# EAGLE board lisa_m (EAGLE 6.3)
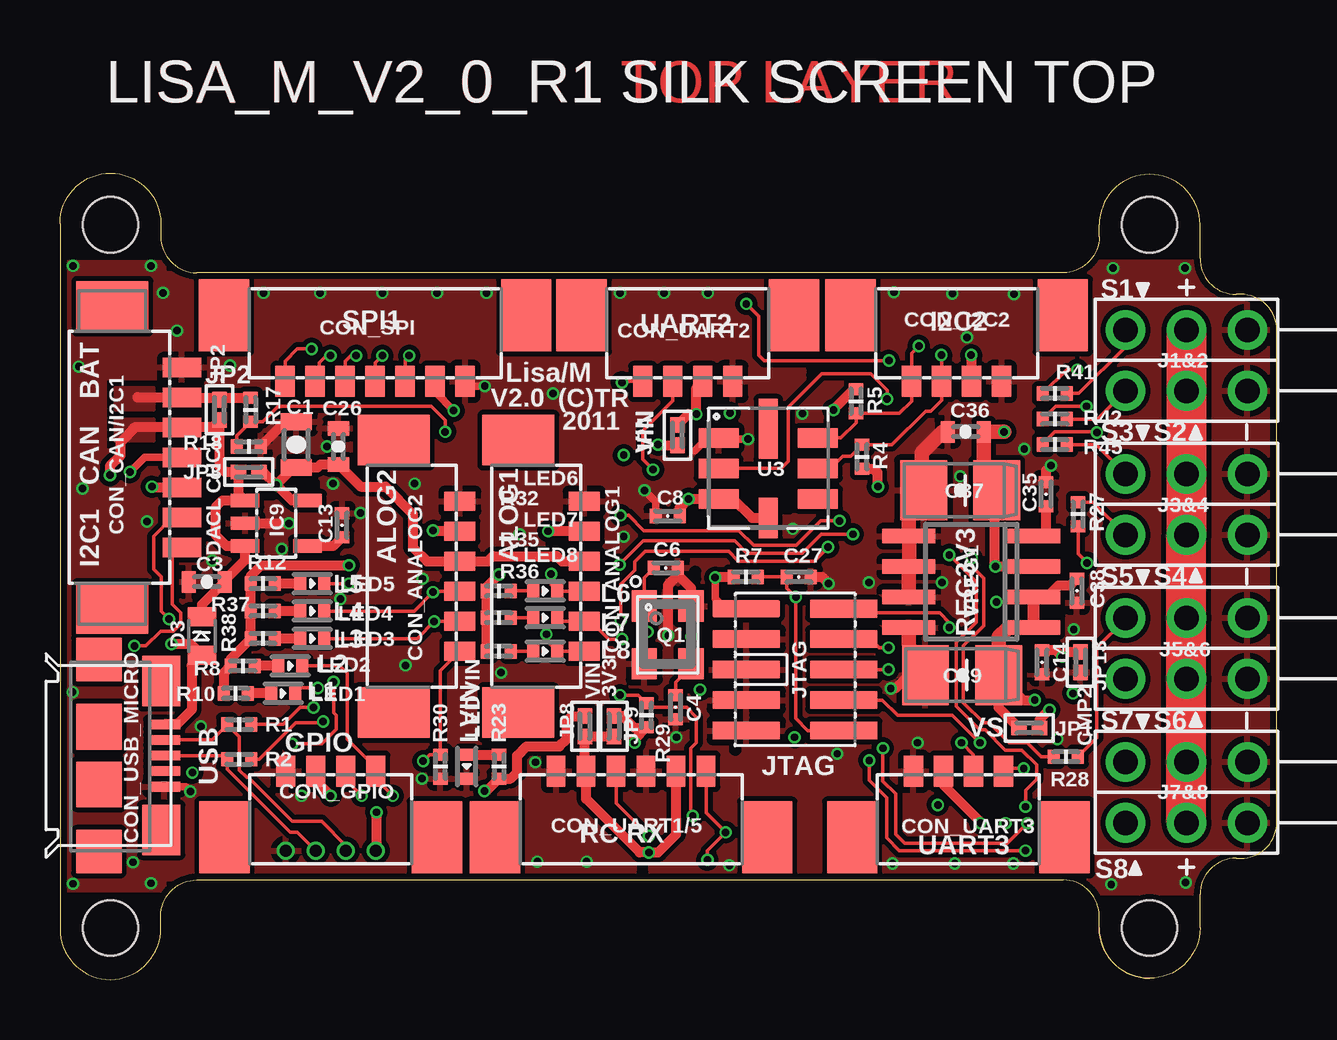
[diagram p3: board, top side]
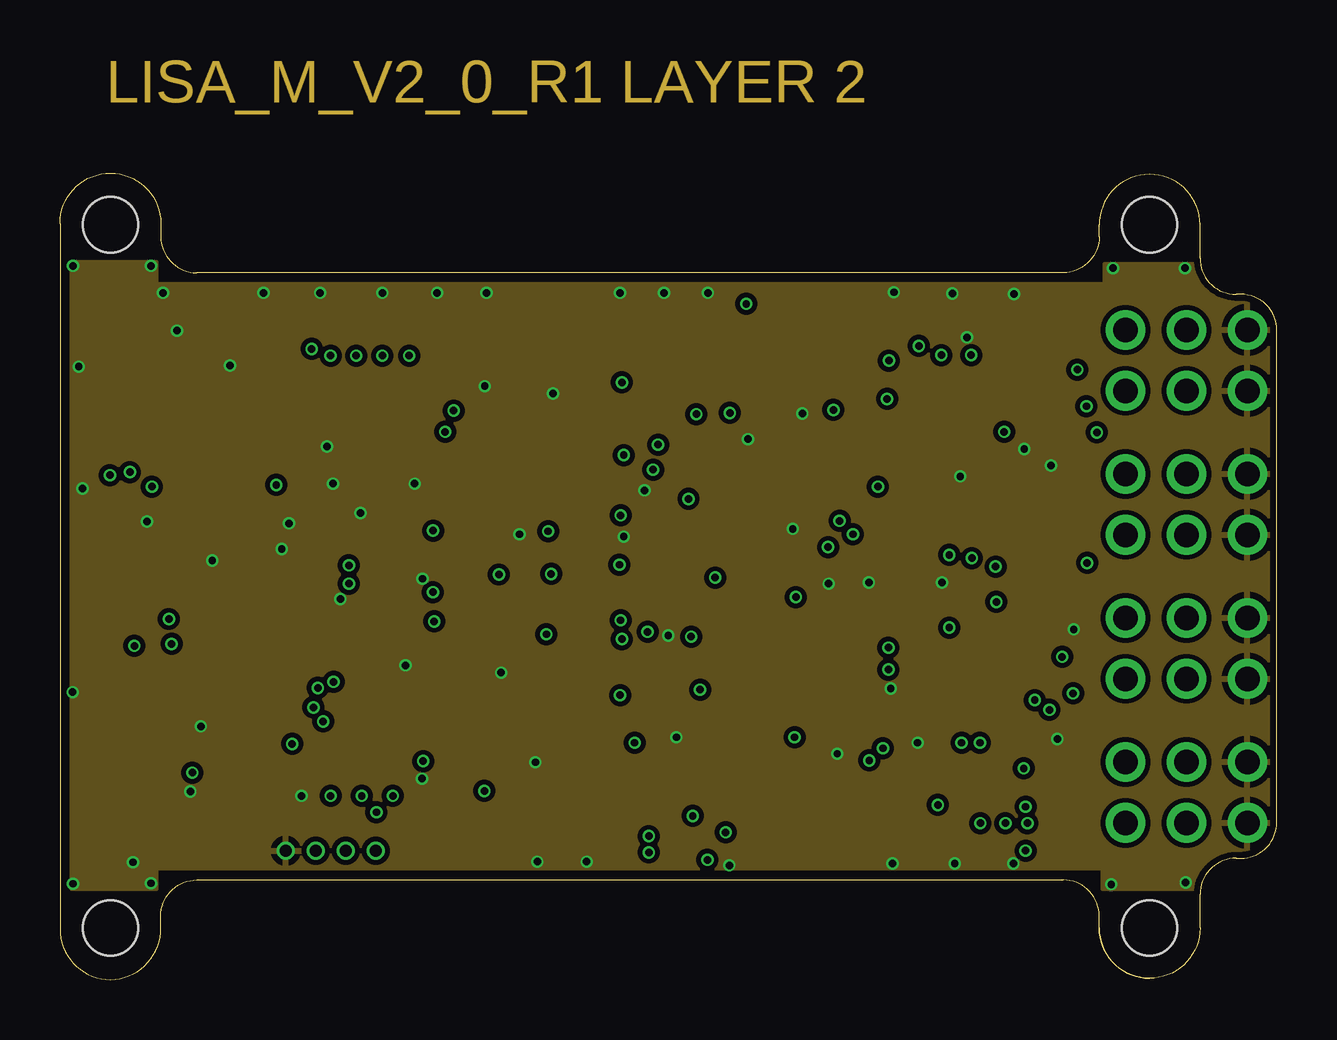
[diagram p4: board, inner layer Route2]
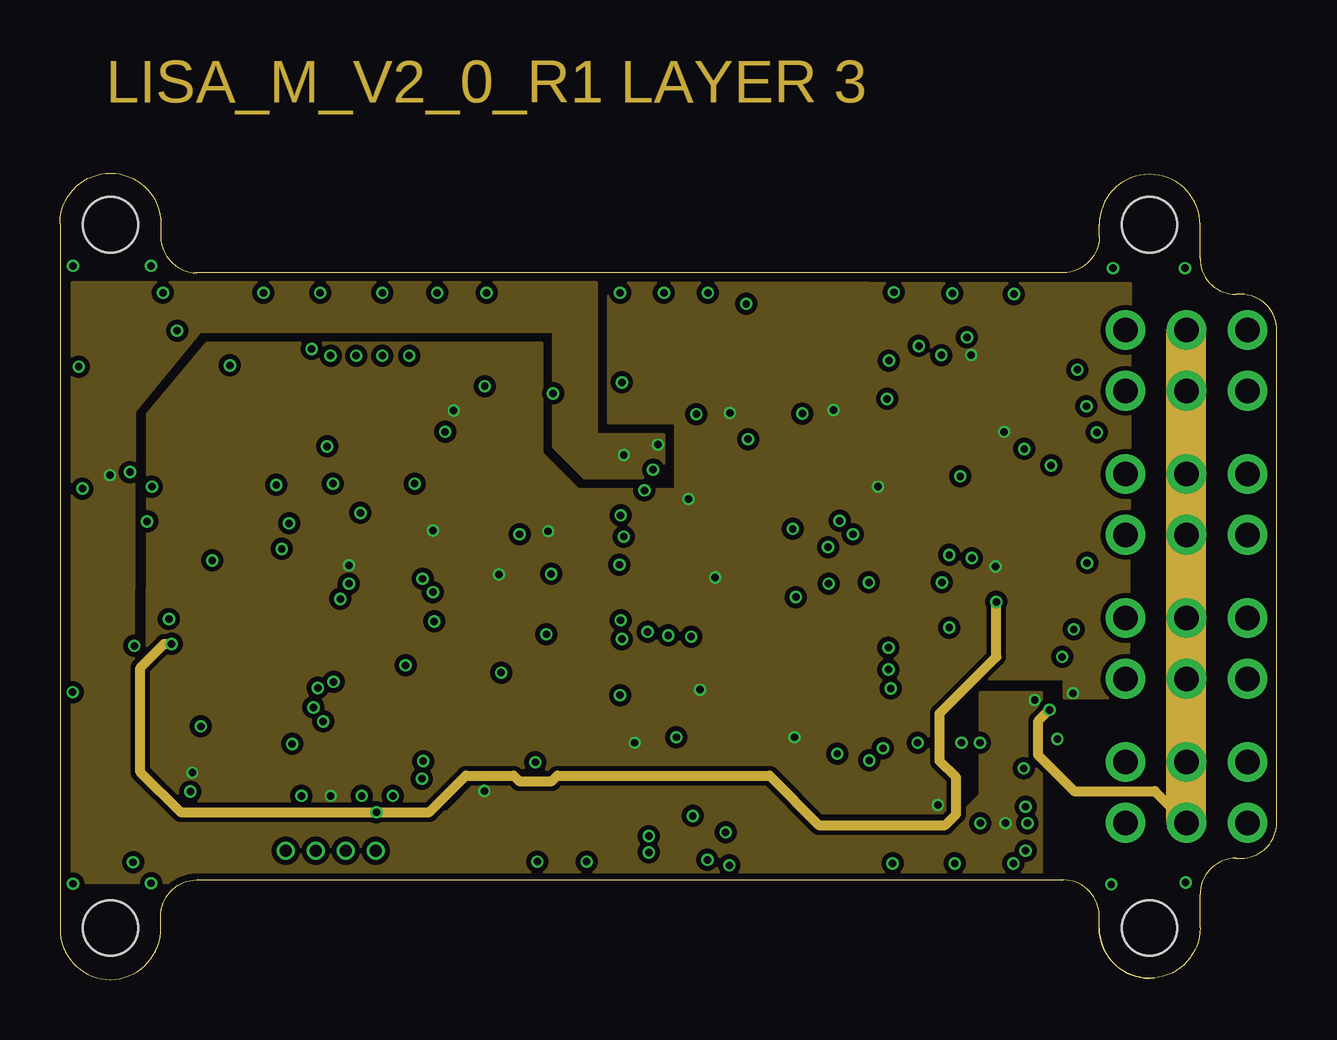
[diagram p5: board, inner layer Route15]
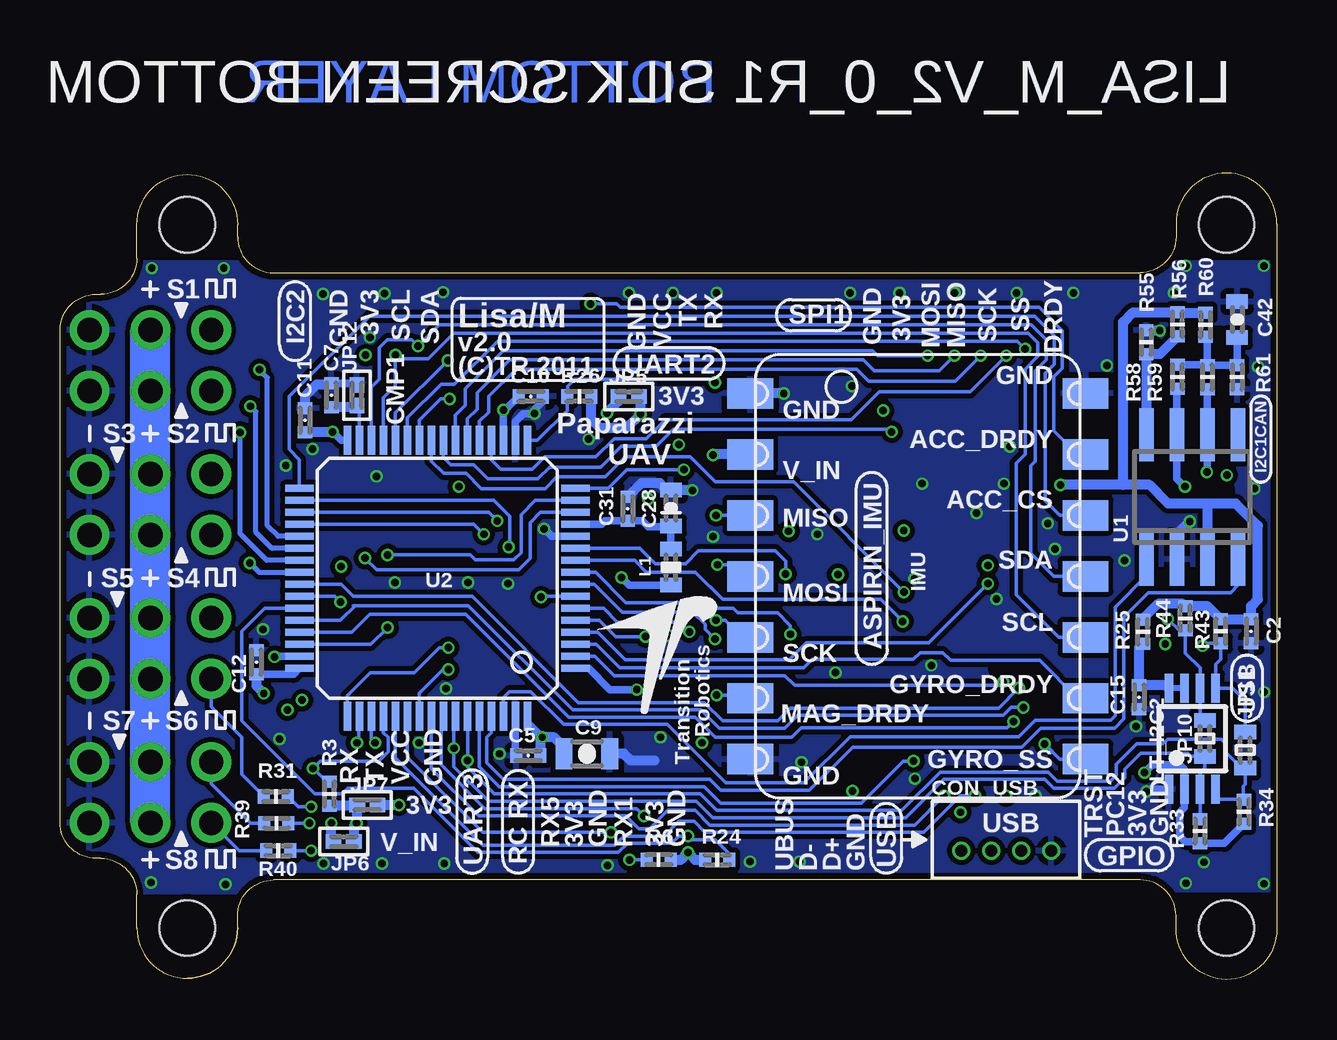
[diagram p6: board, bottom side, seen from below]

Size 50.7 x 33.6 mm. Coordinates in mm from the lower left corner, seen from the top.
Outline: 43.3,2.15 arc90 45.4,0.05
Outline: 45.4,0.05 arc-90 43.3,2.15
Outline: 43.3,2.15 43.3,2.65 arc90 41.8,4.15 5.7,4.15 arc90 4.2,2.65 4.2,2.15 arc-90 2.1,0 arc-90 0,2.1 0,31.5 arc-90 2.1,33.6 arc-90 4.2,31.5 4.2,30.95 arc90 5.7,29.45 41.8,29.45 arc90 43.3,30.95 43.3,31.45 arc-90 45.4,33.55 arc-90 47.5,31.45 47.5,30.05 arc90 49,28.55 49.2,28.55 arc-90 50.7,27.05 50.7,6.55 arc-90 49.2,5.05 49,5.05 arc90 47.5,3.55 47.5,2.15 arc-90 45.4,0.05
Copper layers (1*2+15*16): Top 0.035mm / dielectric 0.2mm / Route2 0.035mm / dielectric 1.5mm / Route15 0.035mm / dielectric 0.2mm / Bottom 0.035mm
Design rules "default": minimum track width 0.15mm, minimum drill 0.3mm, track to track 0.15mm, track to pad 0.15mm, pad to pad 0.15mm, via to via 0.15mm, smd to smd 0.15mm, copper to edge 10mil, drill to drill 8mil, minimum pad ring 0.1mm, minimum via ring 0.1mm, stop-mask expansion 14mil, vias tented up to drill 0.31mm, thermal gap 10mil
Net classes: 0 default: width 0.152 mm, drill 0.305 mm, clearance 0.152 mm
Holes 2.3 mm at 2.1,2.15 2.1,31.45 45.4,31.45 45.4,2.15
tKeepout: area 0.1,0.2 to 4.1,4.2; area 43.4,0.2 to 47.4,4.2; area 0.1,29.5 to 4.1,33.5; area 43.4,29.5 to 47.4,33.5
tRestrict: area 41.6,15.2 to 41.7,15.4; area 39.5,15.1 to 39.6,15.5; area 40.3,20.3 to 40.6,20.3; area 27.3,23.2 to 27.6,23.3; area 31.3,25.2 to 31.4,25.5; area 26.4,16.7 to 26.5,17; area 24.9,16.4 to 25,16.6; area 7.4,16.3 to 7.5,16.5; area 13.2,21 to 13.5,21.1; area 40.4,13 to 40.7,13.1; area 35.8,17.8 to 36.1,17.9; area 22.8,17.6 to 22.9,17.7; 12 more areas
bRestrict: area 2.3,26.9 to 2.5,27; area 2,20.3 to 2.1,20.5; area 2.2,24.5 to 2.3,24.7; area 7.9,23.5 to 8.1,23.6; area 3.5,16.8 to 3.6,17; area 4.8,16.8 to 4.9,17; area 0.4,14.5 to 0.5,14.6; area 5.1,10.4 to 5.2,10.6; area 11.7,12.8 to 11.8,13; area 27.5,20 to 27.6,20.2; area 30.5,24.7 to 30.7,24.9; area 31.3,9.9 to 31.4,10.1; 3 more areas

## Footprints (pad centres in the part's own frame; a part is rotated, then mirrored left to right if it is on the bottom)
0805-CAP = smd 0.7 x 1.3: P$1 -0.95,0; P$2 0.95,0
0402-CAP = smd 0.5 x 0.6: P$1 -0.5,0; P$2 0.5,0
0603-CAP = smd 0.6 x 0.9: P$1 -0.75,0; P$2 0.75,0
0603-POL-CAP = smd 0.6 x 0.9: + -0.75,0; - 0.75,0
3528/B = smd 1.95 x 2.5: + -1.525,0; - 1.525,0
PB-53398-06 = smd 0.8 x 1.3: 1 -3.125,1.25; 2 -1.875,1.25; 3 -0.625,1.25; 4 0.625,1.25; 5 1.875,1.25; 6 3.125,1.25 | smd 2.1 x 3: PAD1 -5.675,-1.5; PAD2 5.675,-1.5
PB-53261-07 = smd 0.8 x 1.6: 1 -3.75,1.1; 2 -2.5,1.1; 3 -1.25,1.1; 4 0,1.1; 5 1.25,1.1; 6 2.5,1.1; 7 3.75,1.1 | smd 2.1 x 3: MNT1 -6.3,-1.8; MNT2 6.3,-1.8
PB-53398-04 = smd 0.8 x 1.3: 1 -1.875,1.25; 2 -0.625,1.25; 3 0.625,1.25; 4 1.875,1.25 | smd 2.1 x 3: PAD1 -4.425,-1.5; PAD2 4.425,-1.5
PB-53398-07 = smd 0.8 x 1.3: 1 -3.75,1.25; 2 -2.5,1.25; 3 -1.25,1.25; 4 0,1.25; 5 1.25,1.25; 6 2.5,1.25; 7 3.75,1.25 | smd 2.1 x 3: PAD1 -6.3,-1.5; PAD2 6.3,-1.5
PB-53398-06' = smd 0.775 x 1.3: 1 -3.125,1.25; 2 -1.875,1.25; 3 -0.625,1.25; 4 0.625,1.25; 5 1.875,1.25; 6 3.125,1.25 | smd 2.1 x 3: PAD1 -5.675,-1.5; PAD2 5.675,-1.5
PB-53047-04 = drill 0.5: 1 -1.875,0; 2 -0.625,0; 3 0.625,0; 4 1.875,0
ZX62-B-5PA = smd 1.8 x 1.9: GND_LEFT -4,0; GND_RIGHT 4,0 | smd 1.9 x 1.9: GND_MID_LEFT -1.2,0; GND_MID_RIGHT 1.2,0 | smd 2.1 x 1.6: GND_UP_LEFT -3.1,2.6; GND_UP_RIGHT 3.1,2.6 | smd 0.4 x 1.35: PIN_1 -1.3,2.725; PIN_2 -0.65,2.725; PIN_3 0,2.725; PIN_4 0.65,2.725; PIN_5 1.3,2.725
MICROMELF-R = smd 0.8 x 1.2: A 0.8,0; C -0.8,0
SOT23-5 = smd 0.55 x 1.2: 1 -0.95,-1.3; 2 0,-1.3; 3 0.95,-1.3; 4 0.95,1.3; 5 -0.95,1.3
ASPIRIN_1 = smd 1.905 x 1.27: P$1 -6.985,7.62; P$2 -6.985,5.08; P$3 -6.985,2.54; P$4 -6.985,0; P$5 -6.985,-2.54; P$6 -6.985,-5.08; P$7 -6.985,-7.62; P$8 6.985,-7.62; P$9 6.985,-5.08; P$10 6.985,-2.54; P$11 6.985,0; P$12 6.985,2.54; P$13 6.985,5.08; P$14 6.985,7.62
SIP1X3_100 = drill 1.016 pad 1.651: 1 2.54,0; 2 0,0; 3 -2.54,0
0402-SQJMP = smd 0.652 x 0.6: P$1 -0.424,0; P$2 0.424,0
0603-RES = smd 0.6 x 0.9: P$1 -0.75,0; P$2 0.75,0
FTSH-105-DV = smd 0.74 x 2.8: 1 -2.54,-2.03; 2 -2.54,2.03; 3 -1.27,-2.03; 4 -1.27,2.03; 5 0,-2.03; 6 0,2.03; 7 1.27,-2.03; 8 1.27,2.03; 9 2.54,-2.03; 10 2.54,2.03
0603-IND = smd 0.6 x 0.9: P$1 -0.75,0; P$2 0.75,0
0402-LED = smd 0.5 x 0.6: A 0.5,0; C -0.5,0
TSSOP_B3 = smd 1.2 x 0.35: 1 -2.925,0.975; 2 -2.925,0.325; 3 -2.925,-0.325; 4 -2.925,-0.975; 5 1.275,-0.975; 6 1.275,-0.325; 7 1.275,0.325; 8 1.275,0.975
ABM8 = smd 1.3 x 1.05: P$1 -1.2,-0.975; P$2 1.2,-0.975; P$3 1.2,0.975; P$4 -1.2,0.975
0402-RES = smd 0.5 x 0.6: P$1 -0.5,0; P$2 0.5,0
SO-08 = smd 0.6 x 2.2: 1 -1.905,-2.6; 2 -0.635,-2.6; 3 0.635,-2.6; 4 1.905,-2.6; 5 1.905,2.6; 6 0.635,2.6; 7 -0.635,2.6; 8 -1.905,2.6
LQFP64 = smd 1.2 x 0.3: 1 -5.75,3.75; 2 -5.75,3.25; 3 -5.75,2.75; 4 -5.75,2.25; 5 -5.75,1.75; 6 -5.75,1.25; 7 -5.75,0.75; 8 -5.75,0.25; 9 -5.75,-0.25; 10 -5.75,-0.75; 11 -5.75,-1.25; 12 -5.75,-1.75; 13 -5.75,-2.25; 14 -5.75,-2.75; 15 -5.75,-3.25; 16 -5.75,-3.75; 33 5.75,-3.75; 34 5.75,-3.25; 35 5.75,-2.75; 36 5.75,-2.25; 37 5.75,-1.75; 38 5.75,-1.25; 39 5.75,-0.75; 40 5.75,-0.25; 41 5.75,0.25; 42 5.75,0.75; 43 5.75,1.25; 44 5.75,1.75; 45 5.75,2.25; 46 5.75,2.75; 47 5.75,3.25; 48 5.75,3.75 | smd 0.3 x 1.2: 17 -3.75,-5.75; 18 -3.25,-5.75; 19 -2.75,-5.75; 20 -2.25,-5.75; 21 -1.75,-5.75; 22 -1.25,-5.75; 23 -0.75,-5.75; 24 -0.25,-5.75; 25 0.25,-5.75; 26 0.75,-5.75; 27 1.25,-5.75; 28 1.75,-5.75; 29 2.25,-5.75; 30 2.75,-5.75; 31 3.25,-5.75; 32 3.75,-5.75; 49 3.75,5.75; 50 3.25,5.75; 51 2.75,5.75; 52 2.25,5.75; 53 1.75,5.75; 54 1.25,5.75; 55 0.75,5.75; 56 0.25,5.75; 57 -0.25,5.75; 58 -0.75,5.75; 59 -1.25,5.75; 60 -1.75,5.75; 61 -2.25,5.75; 62 -2.75,5.75; 63 -3.25,5.75; 64 -3.75,5.75
LCC8 = smd 1.67 x 0.8: 1 -2.065,1.27; 2 -2.065,0; 3 -2.065,-1.27; 5 2.065,-1.27; 6 2.065,0; 7 2.065,1.27 | smd 0.8 x 1.67: 4 0,-2.065 | smd 0.8 x 2.5: 8 0,1.65
SOIC8 = smd 0.6 x 2.2: 1 -1.905,-2.6; 2 -0.635,-2.6; 3 0.635,-2.6; 4 1.905,-2.6; 5 1.905,2.6; 6 0.635,2.6; 7 -0.635,2.6; 8 -1.905,2.6

## Placement (x,y rotation side)
C1  4u7  [0805-CAP]  9.85,22.29 90 top
C2  100n  [0402-CAP]  1.07,14.51 270 bottom
C3  100n  [0603-CAP]  6.12,16.57 180 top
C4  10p  [0402-CAP]  25.65,11.34 90 top
C5  100n  [0402-CAP]  31.19,9.33 0 bottom
C6  10p  [0402-CAP]  25.25,17.15 0 top
C7  100n  [0402-CAP]  39.4,24.34 270 bottom
C8  100n  [0402-CAP]  25.32,19.31 0 top
C9  4u7  [0805-CAP]  28.75,9.41 0 bottom
C10  100n  [0402-CAP]  31.08,24.29 180 bottom
C11  100n  [0402-CAP]  40.49,23.31 270 bottom
C12  100n  [0402-CAP]  42.52,13.22 270 bottom
C13  10n  [0402-CAP]  11.75,18.93 90 top
C14  100n  [0402-CAP]  40.92,13.22 90 top
C15  100n  [0402-CAP]  5.73,11.77 270 bottom
C26  100n  [0603-CAP]  11.6,22.21 90 top
C27  100n  [0402-CAP]  30.79,16.77 180 top
C28  1u  [0603-POL-CAP]  25.24,19.64 90 bottom
C31  10n  [0402-CAP]  27.05,19.62 270 bottom
C35  470p  [0402-CAP]  41.09,20.23 90 top
C36  100n  [0603-CAP]  37.74,22.82 180 top
C37  22u  [3528/B]  37.51,20.38 180 top
C38  100n  [0402-CAP]  42.37,16.19 270 top
C39  22u  [3528/B]  37.59,12.68 180 top
C42  4n7  [0603-CAP]  1.65,27.5 270 bottom
CON_ANALOG1  [PB-53398-06]  20.59,16.8 270 top
CON_ANALOG2  [PB-53398-06]  15.41,16.8 270 top
CON_CAN/I2C1  [PB-53261-07]  3.98,21.75 270 top
CON_GPIO  [PB-53398-04]  11.28,7.43 0 top
CON_I2C2  [PB-53398-04]  37.36,26.17 180 top
CON_SPI  [PB-53398-07]  13.13,26.17 180 top
CON_UART1/5  [PB-53398-06']  23.79,7.43 0 top
CON_UART2  [PB-53398-04]  26.16,26.17 180 top
CON_UART3  [PB-53398-04]  37.43,7.43 0 top
CON_USB  [PB-53047-04]  11.28,5.37 0 bottom
CON_USB_MICRO  ZX62-B-5PA  [ZX62-B-5PA]  1.62,9.33 270 top
D3  1N5819  [MICROMELF-R]  5.91,14.31 270 top
IC9  LP2992 5V  [SOT23-5]  9.01,19.01 270 top
IMU  ASPIRIN  [ASPIRIN_1]  14.96,16.8 0 bottom
J1  CONN_3-1  [SIP1X3_100]  46.94,27.07 0 top
J2  CONN_3-1  [SIP1X3_100]  46.94,24.53 0 top
J3  CONN_3-1  [SIP1X3_100]  46.94,21.07 0 top
J4  CONN_3-1  [SIP1X3_100]  46.94,18.53 0 top
J5  CONN_3-1  [SIP1X3_100]  46.94,15.07 0 top
J6  CONN_3-1  [SIP1X3_100]  46.94,12.53 0 top
J7  CONN_3-1  [SIP1X3_100]  46.94,9.07 0 top
J8  CONN_3-1  [SIP1X3_100]  46.94,6.53 0 top
JP1  0/DNP  [0402-SQJMP]  40.39,10.47 180 top
JP2  0/DNP  [0402-SQJMP]  6.65,23.73 90 top
JP3  0/DNP  [0402-SQJMP]  7.87,21.14 0 top
JP4  0/DNP  [0402-SQJMP]  25.73,22.69 90 top
JP5  0/DNP  [0402-SQJMP]  27.01,24.29 0 bottom
JP6  0/DNP  [0402-SQJMP]  38.88,5.75 0 bottom
JP7  0/DNP  [0402-SQJMP]  37.89,7.27 180 bottom
JP8  0/DNP  [0402-SQJMP]  21.87,10.55 270 top
JP9  0/DNP  [0402-SQJMP]  23.09,10.55 270 top
JP10  0/DNP  [0603-RES]  2.99,10.04 90 bottom
JP11  0/DNP  [0603-RES]  1.32,9.56 90 bottom
JP12  0/DNP  [0402-SQJMP]  38.33,24.34 90 bottom
JP13  0/DNP  [0402-SQJMP]  42.52,13.22 270 top
JTAG  PIN_HDR_EDG_1.27MM_5-2  [FTSH-105-DV]  30.63,12.91 270 top
L1  [0603-IND]  25.24,17.18 90 bottom
LED1  RED  [0402-LED]  9.3,11.92 180 top
LED2  GRN  [0402-LED]  9.6,13.07 180 top
LED3  GRN  [0402-LED]  10.52,14.21 180 top
LED4  RED  [0402-LED]  10.52,15.35 180 top
LED5  GRN  [0402-LED]  10.52,16.49 180 top
LED6  BLU  [0402-LED]  20.22,16.19 180 top
LED7  BLU  [0402-LED]  20.22,15.07 180 top
LED8  BLU  [0402-LED]  20.22,13.68 180 top
LEDVIN  GRN  [0402-LED]  16.95,8.87 90 top
LT_I2C2  PCA9306DP  [TSSOP_B3]  3.52,10.86 90 bottom
Q1  12Mhz  [ABM8]  25.32,14.36 270 top
R1  0R  [0402-RES]  7.47,10.63 0 top
R2  0R  [0402-RES]  7.47,9.18 0 top
R3  10k  [0402-RES]  39.47,7.73 90 bottom
R4  2k2  [0402-RES]  33.42,21.78 90 top
R5  2k2  [0402-RES]  33.17,24.09 270 top
R6  10k  [0402-RES]  25.76,4.99 180 bottom
R7  10k  [0402-RES]  28.58,16.77 180 top
R8  300  [0402-RES]  7.62,13.07 180 top
R10  300  [0402-RES]  7.32,11.92 180 top
R12  300  [0402-RES]  8.46,16.49 180 top
R17  10k  [0402-RES]  7.94,23.73 270 top
R18  2k2  [0402-RES]  7.87,22.21 0 top
R23  2k2  [0402-RES]  18.29,8.87 270 top
R24  10k  [0402-RES]  23.32,4.99 0 bottom
R25  200k  [0402-RES]  5.58,14.49 90 bottom
R26  10k  [0402-RES]  29.06,24.29 180 bottom
R27  100R  [0402-RES]  42.42,19.39 270 top
R28  100R  [0402-RES]  41.91,9.28 180 top
R29  10k  [0402-RES]  24.43,11.01 90 top
R30  10k  [0402-RES]  15.85,8.87 90 top
R31  100R  [0402-RES]  41.71,7.63 0 bottom
R32  80R  [0402-RES]  18.29,16.19 180 top
R33  2k2  [0402-RES]  3.2,6.19 270 bottom
R34  2k2  [0402-RES]  1.37,6.99 270 bottom
R35  80R  [0402-RES]  18.29,15.07 180 top
R36  80R  [0402-RES]  18.29,13.68 180 top
R37  300  [0402-RES]  8.46,15.35 180 top
R38  300  [0402-RES]  8.46,14.21 180 top
R39  100R  [0402-RES]  41.68,6.51 0 bottom
R40  100R  [0402-RES]  41.61,5.37 0 bottom
R41  100R  [0402-RES]  41.45,24.42 180 top
R42  100R  [0402-RES]  41.45,23.35 180 top
R43  2k2  [0402-RES]  2.34,14.51 90 bottom
R44  2k2  [0402-RES]  3.81,15.05 90 bottom
R45  100R  [0402-RES]  41.45,22.29 180 top
R55  0/10k  [0402-RES]  5.44,26.55 270 bottom
R56  0/DNP  [0402-RES]  4.14,27.3 90 bottom
R58  60R/DNP  [0402-RES]  4.14,25.11 90 bottom
R59  60R/DNP  [0402-RES]  2.9,25.1 270 bottom
R60  4k7/DNP  [0402-RES]  2.97,27.28 270 bottom
R61  4k7/DNP  [0402-RES]  1.65,25.1 270 bottom
U1  MCP2551SN  [SO-08]  3.52,20.1 0 bottom
U2  STM32-C-64  [LQFP64]  34.97,16.71 180 bottom
U3  BMP085  [LCC8]  29.51,21.3 0 top
U$1  TR-LOGO  [TR-LOGO]  25.82,13.51 0 bottom
VREG1  MIC5209  [SOIC8]  37.97,16.57 90 top

## Tracks (layer width: path | path; a pad name or v marks a point on that pad's centre or on a via)
+3V3  (via drill 0.31)
  Top 0.152: 27.71,15.45 JTAG.1
  Top 0.305: v16.4,23.71 15.63,24.48 CON_SPI.2 | v27.3,16.75 27.3,15.87 27.71,15.45
  Top 0.406: CON_ANALOG2.2 15.57,18.67 v15.54,18.7 | U3.4 28.84,19.23 28.04,20.02 U3.3 v26.19,20.02 25.82,19.66 C8.P$2 | CON_ANALOG1.2 v20.34,18.67 v20.34,18.68 | CON_I2C2.2 37.98,26 v37.97,26.02 | R5.P$1 33.08,24.59 v32.23,23.73 | R4.P$1 33.9,21.28 34.06,21.12 34.06,20.55 v34.08,20.53 | R7.P$2 27.32,16.77 v27.3,16.75 | VREG1.3 v38.98,17.21 | 38.94,17.26 38.94,20.38 | CON_GPIO.2 10.65,8.28 v11.28,7.66 | v23.95,9.87 23.95,10.02 R29.P$1 23.93,10.5 23.45,10.98 JP9.P$1 | R10.P$2 6.82,12.76 R8.P$2 7.12,13.37 R38.P$2 R37.P$2 R12.P$2 7.96,16.83 8.38,17.26 v12.04,17.26 | R36.P$2 R35.P$2 R32.P$2 17.79,16.38 v18.29,16.88
  Top 0.61: v39.34,22.82 C36.P$1 38.49,20.6 38.42,20.53 38.42,20.46 38.5,20.38 38.94,20.38 C37.+ 39.03,19.69
  Bottom 0.305: 40.67,12.96 U2.48 40.97,12.72 C12.P$2 | L1.P$1 26.98,16.43 v27.3,16.75 | v5.51,8.62 5.18,8.95 4.04,8.95 3.85,8.76 LT_I2C2.2 3.85,7.16 4.04,6.97 4.04,5.98 3.81,5.75 3.26,5.75 R33.P$2 3.19,5.67 2.19,5.67 R34.P$2 | C10.P$2 32.14,23.73 v32.23,23.73 v32.22,23.74 U2.19 | U2.32 38.98,22.46 v39.34,22.82 39.35,22.81 | C9.P$1 29.7,9.69 | U2.1 28.68,12.96 27.79,12.07 v26.67,12.07 | U2.64 31.22,10.71 v30.61,10.09
  Bottom 0.406: 39.35,22.81 C11.P$2 | 29.7,9.69 30.1,10.09 v30.61,10.09 30.69,10.02 C5.P$2 | JP7.P$1 v36.58,7.27 | JP5.P$1 27.43,24.09 v27.91,23.61 | C12.P$2 42.52,12.23 v42.21,11.92
  pour Route15 (isolate 0.203, rank 2): 16.38,7.4 5.21,7.45 3.63,9.03 3.65,23.58 6.12,26.5 20.07,26.5 20.07,21.93 21.59,20.41 25.65,20.41 25.65,23.2 22.86,23.2 22.86,29.04 44.6,28.99 44.6,28.38 44.52,11.74 41.83,11.74 41.83,12.53 37.89,12.51 37.89,7.91 36.82,6.94 31.52,6.94 29.46,8.98 25.15,8.98 23.37,7.2 21.84,7.2 20.19,8.85 17.78,8.85
+5V  (via drill 0.31)
  Top 0.406: CON_ANALOG1.3 20.91,17.42 20.7,17.64 18.03,17.64 17.83,17.43 17.83,17.42 CON_ANALOG2.3 15.3,17.42 14.71,18.02 14.71,19.39 13.56,20.53 12.53,20.53 C26.P$1 10.86,21.46 10.73,21.34 C1.P$1 9.74,21.34 v9.01,20.61 | JP3.P$2 8.48,21.14 v9.01,20.61 | IC9.5 9.66,19.96 v9.01,20.61
  Bottom 0.406: 6.4,20.61 5.3,20.61 4.52,19.83 2.89,19.83 | 6.4,20.61 v9.01,20.61 | 2.89,19.83 U1.3 | R60.P$1 4.13,27.78 R56.P$2 6,27.8 6.4,27.39 6.4,20.61 | 2.89,19.83 1.71,19.83 0.79,18.91 0.79,15.83 1.07,15.55 C2.P$1 R43.P$2 2.87,15.55 R44.P$2 3.92,15.66 4.95,15.66 5.58,15.03 R25.P$2
ADC_1  (via drill 0.31)
  Top 0.152: 21.86,16.19 CON_ANALOG1.4 20.73,16.17 LED6.C 20.47,16.44 v20.47,16.9
  Bottom 0.152: U2.11 26.53,17.96 25.9,17.33 24.63,17.33 24.1,17.87 20.9,17.87 20.47,17.43 v20.47,16.9
ADC_2  (via drill 0.31)
  Top 0.152: v23.41,14.18 22.86,14.18 22.12,14.92 CON_ANALOG1.5 20.87,14.92 LED7.C
  Bottom 0.152: U2.8 28.44,16.46 27.27,15.3 24.33,15.3 23.82,14.79 23.82,14.59 v23.41,14.18
ADC_3  (via drill 0.31)
  Top 0.152: 21.87,13.65 CON_ANALOG1.6 LED8.C 20.26,14.13 v20.26,14.39
  Bottom 0.152: U2.9 28.38,16.96 27.12,15.71 23.85,15.71 23.62,15.48 22.66,15.48 22.45,15.28 20.8,15.28 20.27,14.74 v20.27,14.39 v20.26,14.39
ADC_4  (via drill 0.31)
  Top 0.152: 16.68,16.19 CON_ANALOG2.4 15.57,16.17 v15.54,16.14 14.75,15.35 LED4.C
  Bottom 0.152: U2.25 35.22,21.6 34.72,21.09 33.78,21.09 33.15,20.46 30.48,20.46 30,20.94 27.99,20.94 27.15,21.78 24.43,21.78 23.39,20.74 20.14,20.74 v15.54,16.14
ADC_6  (via drill 0.31)
  Top 0.152: CON_ANALOG2.5 v15.6,14.92 v15.59,14.92 14.88,14.21 LED3.C
  Bottom 0.152: U2.10 26.75,17.46 26.26,16.98 24.23,16.98 23.09,15.83 16.5,15.83 v15.59,14.92
BARO_DRDY  (via drill 0.31)
  Top 0.152: U3.2 30.04,21.3 30.35,21.6 30.35,23.84 31.74,25.23 33.78,25.23 34.46,24.55 v34.46,24.19
  Bottom 0.152: U2.26 35.72,23.31 34.84,24.19 v34.46,24.19
BOOT0  (via drill 0.31)
  Top 0.152: CON_ANALOG2.6 | CON_ANALOG2.6 15.85,12.86 R30.P$2 15.4,9.37 v15.13,9.1
  Bottom 0.152: U2.60 33.22,8.86 32.41,8.04 23.85,8.04 23.16,7.35 17.32,7.35 15.57,9.1 v15.13,9.1
CAN_CENTER
  Bottom 0.305: R58.P$2 R59.P$1 | R59.P$1 2.9,26.71 R60.P$2 | R59.P$1 R61.P$1 C42.P$2
CAN_H  (via drill 0.31)
  Top 0.406: CON_CAN/I2C1.5 3.86,20.5 v3.83,20.53
  Bottom 0.305: v3.83,20.53 4.16,20.86 U1.7 4.16,24.59 R58.P$1
CAN_L  (via drill 0.31)
  Top 0.305: CON_CAN/I2C1.4 3.52,21.75 v2.92,21.14
  Bottom 0.305: R59.P$2 U1.6 2.89,21.17 v2.92,21.14
CAN_RX
  Bottom 0.152: U1.4 1.62,16.42 1.93,16.11 5.35,16.11 6.38,15.09 6.38,10.86 6.76,10.48 9.83,10.48 10.62,9.69 17.68,9.69 19.48,7.88 23.16,7.88 23.62,8.34 32.23,8.34 32.92,9.03 32.92,10.09 32.72,10.29 U2.61
CAN_TX
  Bottom 0.152: U2.62 32.22,11.75 31.97,12 31.09,12 29.72,10.63 25.39,10.63 22.96,8.19 19.7,8.19 17.77,10.12 10.74,10.12 10.06,10.8 6.91,10.8 6.72,10.99 6.72,15.52 5.43,16.81 U1.1
EXTSPI_DRDY  (via drill 0.31)
  Top 0.152: CON_SPI.7 9.38,25.77 9.88,26.27 v10.48,26.27
  Bottom 0.152: U2.27 36.22,23.4 34.82,24.8 34.27,24.8 32.46,26.6 10.81,26.6 v10.48,26.27
EXTSPI_MISO  (via drill 0.31)
  Top 0.152: CON_SPI.4 13.13,25.69 v13.43,25.99
  Bottom 0.152: U2.22 33.72,23.36 33.33,23.76 33.33,24.45 31.95,25.82 17.22,25.82 16.76,25.36 14.07,25.36 v13.43,25.99
EXTSPI_MOSI  (via drill 0.31)
  Top 0.152: CON_SPI.3 14.38,25.82 v14.55,25.99
  Bottom 0.152: U2.23 34.22,23.52 33.81,23.94 33.81,24.62 32.23,26.2 16.84,26.2 16.64,25.99 v14.55,25.99
EXTSPI_SCK  (via drill 0.31)
  Top 0.152: CON_SPI.5 11.88,25.75 12.12,25.99 v12.34,25.99
  Bottom 0.152: U2.21 33.22,23.25 32.84,23.63 32.84,24.29 31.7,25.44 17.5,25.44 16.99,24.93 13.41,24.93 v12.34,25.99
EXTSPI_SS  (via drill 0.31)
  Top 0.152: CON_SPI.6 10.63,25.22 10.79,25.38 10.79,25.69 11.1,25.99 v11.27,25.99
  Bottom 0.152: U2.20 32.72,21.66 32.33,21.27 31.01,21.27 30.5,21.78 28.37,21.78 27.61,22.54 26.26,22.54 25.48,23.33 17.73,23.33 16.56,24.49 12.77,24.49 v11.27,25.99
FT_USB_DM
  Top 0.152: CON_USB_MICRO.PIN_2 4.36,9.99 6.35,9.99 6.97,10.61 | 6.97,10.61 R1.P$1 | 6.97,10.61 7.47,10.11 7.47,8.72 7.77,8.42 7.85,8.42 9.68,6.59 10.9,6.59 11.9,5.58 CON_USB.2
FT_USB_DP
  Top 0.152: CON_USB_MICRO.PIN_3 6.78,9.33 6.93,9.18 R2.P$1 6.97,8.77 9.6,6.13 9.89,6.13 CON_USB.3
GND  (via drill 0.31)
  Top 0.305: CON_ANALOG1.1 21.81,19.92 | CON_SPI.1 17.07,24.72 v17.7,24.72 | v28.67,22.51 27.39,22.51 27.41,22.54 | U3.1 27.41,22.54 | 35.89,20.66 35.92,20.63 35.92,20.89 | CON_USB_MICRO.PIN_5 5.23,8.03 v5.43,7.83 | C8.P$1 24.82,19.91 v24.35,20.38 | 27.41,22.54 26.95,22.54 26.44,22.03
  Top 0.406: 35.37,13.99 36.02,13.33 34.84,12.15 34.59,12.15 | IC9.2 v9.54,19.01 | C1.P$2 9.39,23.24 R18.P$2 | C35.P$2 41.09,21.22 v41.3,21.42 | C27.P$1 31.75,16.77 v32.03,16.49 | 25.63,10.81 C4.P$1 25.66,10.83 | v25.34,14.34 25.34,16.44 25.73,16.83 25.73,17.13 C6.P$2 25.76,16.85 26.29,16.32 26.29,15.61 26.31,15.58
  Top 0.61: VREG1.7 VREG1.6 | 35.37,13.99 VREG1.8 | 36.02,13.33 36.67,12.68 | 35.68,20.53 35.37,20.22 VREG1.5 35.38,18.47 35.38,17.18 | C36.P$2 36.78,22.82 35.92,21.95 35.92,20.45 C37.-
  Bottom 0.305: 4.16,16.67 U1.2 | U2.12 30.21,18.46 v30.53,18.78 | LT_I2C2.1 5.33,7.93 v5.43,7.83 | U2.18 31.72,23.25 31.39,23.58 v30.93,23.58 30.93,23.74 30.58,24.09 C10.P$1 | U2.63 31.72,9.37 | C7.P$1 38.45,24.84 38.33,24.72
  Bottom 0.406: v24.35,20.38 24.37,20.39 C28.- 25.41,20.39 25.7,20.69 26.48,20.69 C31.P$1 | U1.2 4.16,18.55 v3.63,19.09 | C9.P$2 27.2,9.41 26.92,9.13 25.93,9.13 | C11.P$1 40.49,24.32 40.01,24.8 39.44,24.8 C7.P$1 | v4.88,27.04 5.38,27.04 5.41,27.01 | v20.54,24.42 22.02,24.42
  other vias: 7.08,25.59 0.78,25.54 19.81,9.05 11.13,22.21 9.24,17.94 19.89,4.91 39.75,28.56 34.69,4.84 37.28,4.84 39.72,4.84 8.48,28.61 10.84,28.61 13.43,28.61 17.77,28.61 15.72,28.61 23.34,28.61 25.17,28.61 26.99,28.61 14.4,13.09 36.75,16.55 0.93,20.46 4.29,28.61 0.53,11.97 6.34,17.46 3.04,4.89 12.52,19.44 23.49,18.45 35.74,9.87 14.78,20.66 19.15,18.55 15.08,8.37 34.74,28.64 37.18,28.58 18.38,12.79 3.79,4.01 0.54,3.99 43.8,3.96 46.9,4.04 0.54,29.74 3.79,29.74 46.88,29.64 43.88,29.64 32.38,9.41 25.68,10.09 37.79,26.76 34.61,12.13 42.24,14.59 41.55,10.02 10.06,7.66 5.87,10.55 15.11,16.7 11.68,15.86 11.37,20.66 37.51,20.96 33.7,16.55 40.18,22.11 21.95,4.91 27.89,4.76
  pour Route2 (isolate 0.203): 0.48,3.77 0.48,29.91 4.04,29.91 4.04,28.99 43.51,28.99 43.51,29.83 50.71,29.83 50.71,3.77 43.43,3.77 43.43,4.61 4.04,4.61 4.04,3.77
  pour Bottom (isolate 0.203, rank 2): 0.02,3.69 0.1,29.91 50.73,29.91 50.65,3.62 42.52,3.62 42.52,4.15 5.03,4.15 5.03,3.69
  pour Top (isolate 0.203, rank 2): 0.02,29.91 4.37,29.91 4.37,29.45 42.69,29.45 42.69,29.92 50.74,29.92 50.66,3.57 42.77,3.57 42.77,4.15 4.37,4.15 4.37,3.69 0.02,3.69 0.02,22.06 4.29,22.06 4.29,25.03 0.02,25.03
  pour Top (no thermals): 0.02,25.8 1.85,25.8 1.85,21.9 0.02,21.9
I2C2_SCL  (via drill 0.31)
  Top 0.152: v36.72,26.02 36.73,26.01 CON_I2C2.3 36.73,24.14 36.27,23.68 36.07,23.68 34.66,22.28 R4.P$2 32.95,21.8 32.61,21.8 32.11,21.3 U3.6
  Bottom 0.152: IMU.P$10 9.09,14.26 10.87,16.04 10.87,21.5 10.49,21.88 10.49,25.44 9.96,25.97 9.96,26.53 10.36,26.93 34.29,26.93 35.36,25.87 36.57,25.87 v36.72,26.02 36.73,26.01 36.73,24.72 37.22,24.23 U2.29
I2C2_SDA  (via drill 0.31)
  Top 0.152: U3.7 32.53,22.56 33.17,23.2 R5.P$2 34.98,23.59 35.48,24.09 CON_I2C2.4 35.48,26.1 v35.78,26.4
  Bottom 0.152: IMU.P$11 9.29,16.8 10.26,17.76 10.26,21.4 10.06,21.6 10.06,25.36 9.6,25.82 9.6,26.65 10.24,27.29 34.89,27.29 v35.78,26.4 36.04,26.65 37.06,26.65 37.39,26.32 37.39,25 37.72,24.67 U2.30
IMU_ACC_CS
  Bottom 0.152: IMU.P$12 9.04,19.34 9.65,19.95 9.65,25.26 9.27,25.64 9.27,26.83 10.08,27.65 37.8,27.65 41.15,24.29 41.15,22.09 40.72,21.66 U2.33
IMU_ACC_DRDY  (via drill 0.31)
  Top 0.152: v34.54,25.79 29.34,25.79 29.11,26.02 29.11,27.64 v28.59,28.15
  Bottom 0.152: IMU.P$13 8.3,21.88 9.16,22.74 9.17,22.74 9.3,22.87 9.3,25.1 8.94,25.46 8.94,27.04 9.91,28 27.36,28 27.51,28.15 v28.59,28.15 | U2.28 36.72,23.61 v34.54,25.79
IMU_GYRO_DRDY
  Bottom 0.152: U2.3 28.35,13.96 27.38,12.99 19.71,12.99 19.36,13.35 15.14,13.35 14.86,13.62 13.92,13.62 13.59,13.29 9.88,13.29 8.31,11.72 IMU.P$9
IMU_GYRO_SS  (via drill 0.31)
  Top 0.152: v9.67,9.81 10.9,9.81 11.51,10.42 11.51,11.01 11.4,11.12 v11.4,12.41
  Bottom 0.152: U2.2 28.41,13.46 27.6,12.66 20.5,12.66 20.09,12.25 11.55,12.25 v11.4,12.41 | IMU.P$8 9.04,9.18 v9.67,9.81
IMU_MAG_DRDY  (via drill 0.31)
  Top 0.152: v26.36,6.82 26.29,6.89 26.29,9.64 26.52,9.87 26.52,10.93 26.11,11.34 24.74,11.34 24.57,11.51 R29.P$2 24.1,11.85 v23.34,11.85
  Bottom 0.152: IMU.P$6 22.25,11.72 22.38,11.85 v23.34,11.85 | U2.57 34.82,10.86 34.82,8.95 32.99,7.12 26.67,7.12 v26.36,6.82
IMU_SPI_MISO  (via drill 0.31)
  Top 0.152: v23.36,19.34 23.7,19.34 24.33,18.7 28.29,18.7 28.9,18.09 30.68,18.09 31.69,19.11 v32.48,19.11
  Bottom 0.152: IMU.P$3 v23.36,19.34 | U2.35 32.83,19.46 v32.48,19.11
IMU_SPI_MOSI  (via drill 0.31)
  Top 0.152: v33.04,18.55 31.72,18.55 30.93,17.76 28.62,17.76 28.11,18.27 24.3,18.27 v23.31,17.28
  Bottom 0.152: U2.36 33.45,18.96 v33.04,18.55 | v23.31,17.28 22.42,17.28 IMU.P$4
IMU_SPI_SCK  (via drill 0.31)
  Top 0.152: v23.36,14.97 23.36,16.47 23.95,17.05 23.95,17.41 24.38,17.84 27.86,17.84 28.27,17.43 31.42,17.43 v32,18.02
  Bottom 0.152: IMU.P$5 21.94,14.23 22.25,14.23 22.99,14.97 v23.36,14.97 | U2.34 32.62,19.96 31.95,19.29 31.95,18.07 v32,18.02
JTAG_RST  (via drill 0.31)
  Top 0.152: JTAG.10 31.17,10.37 30.66,10.88 v30.66,15.94 30.29,16.3 C27.P$2 R7.P$1
  Bottom 0.152: v30.66,15.94 30.63,15.96 U2.7
JTAG_TCK  (via drill 0.31)
  Top 0.152: v34.52,13.83 34.14,13.83 33.78,14.18 JTAG.4
  Bottom 0.152: U2.49 38.72,11.83 37.77,12.79 35.94,12.79 34.9,13.83 v34.52,13.83
JTAG_TDI  (via drill 0.31)
  Top 0.152: JTAG.8 34.27,11.64 34.9,11.01 37.19,11.01 v38.33,9.87
  Bottom 0.152: v38.33,9.87 38.25,9.94 38.25,10.94 U2.50
JTAG_TDO  (via drill 0.31)
  Top 0.152: JTAG.6 v34.52,12.91
  Bottom 0.152: U2.55 35.72,11.94 34.75,12.91 v34.52,12.91
JTAG_TMS  (via drill 0.31)
  Top 0.152: JTAG.2 32.84,15.28 36.65,15.28 37.05,14.87 v37.05,14.67
  Bottom 0.152: U2.46 37.76,13.96 v37.05,14.67
JTAG_TRST  (via drill 0.31)
  Top 0.152: LED2.C 11.66,13.06 11.96,12.76 11.96,10.02 13.15,8.83 CON_GPIO.4 13.15,8.37 v13.87,7.66
  Bottom 0.152: v13.87,7.66 15.09,6.44 23.62,6.44 24.23,7.05 25.38,7.05 26.14,6.28 26.59,6.28 27.13,6.82 33.25,6.82 35.22,8.79 U2.56
LED1  (via drill 0.31)
  Top 0.152: LED1.C 10.03,12.15 v10.74,12.15
  Bottom 0.152: U2.41 38.98,16.46 38.48,15.96 33.53,15.96 29.11,11.54 23.85,11.54 23.09,10.78 20.8,10.78 20.27,11.31 11.58,11.31 v10.74,12.15
LED2  (via drill 0.31)
  Top 0.152: LED5.C v12.04,16.49
  Bottom 0.152: U2.4 28.29,14.46 27.15,13.32 20.32,13.32 19.61,14.03 14.5,14.03 v12.04,16.49
LT_I2C1_SCL  (via drill 0.31)
  Top 0.152: CON_CAN/I2C1.6 4.68,19.25 3.91,18.48 3.91,17.08 4.21,16.78 4.21,15.35 v4.54,15.02
  Bottom 0.152: JP10.P$2 3.2,11 LT_I2C2.6 3.2,12.99 3.81,13.6 R44.P$1 4.07,14.55 v4.54,15.02
LT_I2C1_SDA  (via drill 0.31)
  Top 0.152: CON_CAN/I2C1.7 4.81,18 4.67,17.87 4.67,15.63 5.03,15.28 5.03,14.82 4.72,14.51 4.19,14.51 3.58,13.9 v3.1,13.9
  Bottom 0.152: JP11.P$2 1.31,11.61 1.83,12.13 LT_I2C2.5 2.55,13.13 2.34,13.35 R43.P$1 2.99,14.01 v3.1,13.9
N$1
  Bottom 0.406: U1.8 R55.P$2 4.87,26.05 R56.P$1
N$4
  Top 0.406: LED1.A R10.P$1
N$5
  Top 0.152: LED6.A R32.P$1
N$6
  Top 0.406: IC9.4 11.38,18.06 C13.P$1
N$7
  Top 0.406: C35.P$1 41.09,18.58 41.1,18.58 40.67,18.58 VREG1.4
N$8
  Bottom 0.254: LT_I2C2.7 LT_I2C2.8
  Bottom 0.406: R25.P$1 5.74,13.84 C15.P$1 4.64,12.27 LT_I2C2.8
N$9
  Top 0.152: LED7.A R35.P$1
N$10
  Top 0.406: LED2.A R8.P$1
N$11
  Top 0.152: LED8.A R36.P$1
N$12
  Top 0.406: LEDVIN.A R23.P$1
N$13
  Top 0.406: LED5.A R12.P$1
N$14
  Top 0.406: LED4.A R37.P$1
N$15
  Top 0.406: LED3.A R38.P$1
OSC_IN  (via drill 0.31)
  Top 0.152: v26.3,14.29 v26.29,14.28 Q1.P$3 26.29,13.02 25.65,12.38 C4.P$2
  Bottom 0.152: U2.5 28.23,14.96 27.55,14.29 v26.3,14.29
OSC_OUT  (via drill 0.31)
  Top 0.152: v24.48,14.49 24.34,14.62 Q1.P$1 24.34,16.75 C6.P$1
  Bottom 0.152: U2.6 28.05,15.46 27.48,14.89 24.89,14.89 v24.48,14.49
PC12  (via drill 0.31)
  Top 0.152: v12.57,7.66 11.9,8.33 CON_GPIO.3
  Bottom 0.152: U2.53 36.72,9.23 33.09,5.6 27.58,5.6 27.2,5.98 25.53,5.98 24.92,6.59 24.28,6.59 23.82,6.13 14.71,6.13 13.18,7.66 v12.57,7.66
S1
  Top 0.152: R41.P$1 42.44,24.42 44.4,26.37 J1.3
S2
  Top 0.152: R42.P$1 43.22,23.35 J2.3
S3
  Top 0.152: R45.P$1 43.18,22.29 J3.3
S4
  Top 0.152: R27.P$1 43.04,19.89 J4.3
S5
  Top 0.152: R28.P$1 43.2,10.08 43.2,13.83 44.4,15.02 J5.3
S6
  Bottom 0.152: R31.P$1 43.13,8.55 43.13,10.09 44.4,11.36 J6.3
S7
  Bottom 0.152: R39.P$1 42.75,6.51 44.4,8.16 J7.3
S8
  Bottom 0.152: R40.P$1 43.24,5.37 J8.3
SERVO_1  (via drill 0.31)
  Top 0.152: R41.P$2 41.94,25.41 v42.39,25.41
  Bottom 0.203: v42.39,25.41 42.06,25.08 42.06,18.91 41.61,18.46 U2.37
SERVO_2  (via drill 0.31)
  Top 0.152: R42.P$2 41.49,23.89 v42.77,23.89
  Bottom 0.203: U2.38 41.88,17.96 42.54,18.63 42.54,23.66 v42.77,23.89
SERVO_3  (via drill 0.31)
  Top 0.152: R45.P$2 40.95,22.32 41.45,22.82 43.17,22.82 v43.2,22.79
  Bottom 0.203: U2.39 42.09,17.46 43.2,18.58 v43.2,22.79
SERVO_4  (via drill 0.31)
  Top 0.152: R27.P$2 42.42,17.73 v42.79,17.36
  Bottom 0.203: U2.40 42.4,16.96 v42.79,17.36
SERVO_5  (via drill 0.31)
  Top 0.152: v37.99,17.56 37.99,17.21 38.48,16.72 38.48,14.74 37.64,13.9 37.64,11.54 38.48,10.7 38.71,10.7 39.55,9.87 40.31,9.87 40.89,9.28 R28.P$2
  Bottom 0.152: U2.14 30.69,19.46 31.11,19.03 31.11,17.56 31.59,17.08 37.51,17.08 v37.99,17.56
SERVO_6  (via drill 0.31)
  Top 0.152: v37.05,17.69 38.18,16.56 38.18,14.89 37.34,14.06 37.34,11.39 38.33,10.4 38.56,10.4 39.4,9.56 40.08,9.56 40.69,8.95 40.69,8.34 40.23,7.88 v40.23,7.2
  Bottom 0.152: v37.05,17.69 33.6,17.69 33.4,17.48 31.8,17.48 31.49,17.79 31.49,19.37 30.89,19.96 U2.15 | v40.23,7.2 40.77,7.2 R31.P$2
SERVO_7/I2C1_SCL  (via drill 0.31)
  Top 0.152: v40.31,6.51 39.47,5.67 35.2,5.67 34.82,6.06 34.82,7.73 34.29,8.27 v34.29,9.64
  Bottom 0.152: R33.P$1 LT_I2C2.3 3.2,8.63 3,8.82 3,9.28 JP10.P$1 3,9.31 3.58,9.31 3.71,9.43 5.66,9.43 6.34,8.75 6.34,8.4 6.78,7.96 9.3,7.96 9.68,8.34 13.87,8.34 15.47,6.74 23.5,6.74 24.18,7.43 32.84,7.43 34.29,8.87 v34.29,9.64 34.29,10.9 U2.58 | R33.P$1 | v40.31,6.51 R39.P$2
SERVO_8/I2C1_SDA  (via drill 0.31)
  Top 0.152: v40.23,5.37 34.98,5.37 34.44,5.9 34.44,7.58 33.72,8.3 v33.72,9.13
  Bottom 0.152: LT_I2C2.4 2.55,7.59 2.46,7.5 1.39,7.5 R34.P$1 1.4,7.52 1.4,8.06 1.31,8.14 JP11.P$1 1.46,8.81 2.11,9.46 2.11,9.81 2.31,10.02 4.54,10.02 4.74,9.81 5.84,9.81 6.68,8.98 6.68,8.52 6.93,8.27 9.14,8.27 9.53,8.65 14.02,8.65 15.62,7.05 23.34,7.05 24.03,7.73 32.61,7.73 33.72,8.84 v33.72,9.13 U2.59 | v40.23,5.37 R40.P$2
SERVO_BUS  (via drill 0.31)
  Top 0.406: JP1.P$1 40.81,10.82 v41.22,11.24
  Top 1.676: J1.2 J2.2 J3.2 J4.2 J5.2 J6.2 J7.2 J8.2
  Route15 0.406: 40.77,9.34 40.77,9.33 | 40.77,9.34 40.77,10.78 v41.22,11.24 | 40.77,9.34 42.25,7.85 45.62,7.85 J8.2
  Route15 1.676: J8.2 J1.2
  Bottom 1.676: J8.2 J1.2
U1_U5_POW  (via drill 0.31)
  Top 0.406: CON_UART1/5.5 25.67,6.04 24.92,5.29 v24.54,5.29 24.16,5.29 21.92,7.53 CON_UART1/5.2 21.87,8.73 JP8.P$2 JP9.P$2
  Bottom 0.406: R6.P$1 24.84,4.99 v24.54,5.29 24.23,4.99 R24.P$1
U2_POW  (via drill 0.31)
  Top 0.406: JP4.P$2 26.18,23.56 v26.51,23.56 26.51,24.65 CON_UART2.2
  Bottom 0.406: JP5.P$2 26.51,24.22 v26.51,23.56 27.1,22.97 28.19,22.97 28.56,23.34 R26.P$1
U3_POW  (via drill 0.31)
  Top 0.305: CON_UART3.2 36.82,8.66
  Top 0.406: 36.82,8.66 36.82,8.09 38.35,6.57 v38.35,6.51
  Bottom 0.406: JP6.P$2 38.46,6.4 v38.35,6.51 38.31,6.55 JP7.P$2 38.36,7.23 R3.P$1
UART1_RX  (via drill 0.31)
  Top 0.152: CON_UART1/5.3 23.17,7.35 v24.54,5.98
  Bottom 0.152: U2.43 42.18,15.46 43.13,14.51 43.13,10.78 40.08,7.73 38.94,7.73 38.71,7.96 35.97,7.96 33.3,5.29 27.43,5.29 27.05,5.67 25.22,5.67 24.92,5.98 v24.54,5.98 24.38,5.83 23.39,5.83 22.82,5.25 R24.P$2
UART2_RX  (via drill 0.31)
  Top 0.152: CON_UART2.4 23.46,24.92 v23.41,24.88
  Bottom 0.152: U2.17 30.81,22.46 29.57,23.71 R26.P$2 29.54,24.31 29.54,24.72 29.26,25 23.54,25 v23.41,24.88
UART2_TX  (via drill 0.31)
  Top 0.152: CON_UART2.3 25.53,24.12 24.28,22.88 24.28,21.68 v24.71,21.25 v24.71,21.24
  Bottom 0.152: U2.16 27.86,20.46 27.08,21.24 v24.71,21.24
UART3_RX  (via drill 0.31)
  Top 0.152: v40.16,8.8 39.43,8.8 CON_UART3.4
  Bottom 0.152: U2.52 37.22,10.28 37.03,10.09 37.03,9.48 37.41,9.1 39.85,9.1 v40.16,8.8 39.59,8.23 R3.P$2
UART3_TX  (via drill 0.31)
  Top 0.152: v37.57,9.87 38.06,9.37 CON_UART3.3
  Bottom 0.152: U2.51 37.72,10.02 v37.57,9.87
UART5_RX  (via drill 0.31)
  Top 0.152: CON_UART1/5.6 26.92,6.95 v27.74,6.13 26.98,5.37 v26.98,4.99
  Bottom 0.152: U2.54 36.22,9.26 33.09,6.13 v27.74,6.13 | R6.P$2 v26.98,4.99
USB_DM  (via drill 0.31)
  Top 0.152: R1.P$2 9.3,10.63 10.01,11.34 v10.56,11.34
  Bottom 0.152: U2.44 39.02,14.96 38.4,15.58 | v10.56,11.34 11.07,11.34 11.4,11.01 19.96,11.01 20.5,10.48 23.24,10.48 24,11.24 29.34,11.24 33.68,15.58 38.4,15.58 | 38.4,15.58 38.48,15.58
USB_DP  (via drill 0.31)
  Top 0.152: R2.P$2 8.31,9.18 9.83,10.7 10.92,10.7 v10.97,10.75
  Bottom 0.152: U2.45 38.55,14.46 37.79,15.22 33.8,15.22 29.51,10.93 24.23,10.93 23.39,10.09 20.21,10.09 19.81,10.5 11.22,10.5 v10.97,10.75
USB_VBUS  (via drill 0.31)
  Top 0.406: CON_USB_MICRO.PIN_1 4.88,10.63 5.49,11.24 5.49,13.08 D3.A 5.44,13.98 v4.65,13.98 | v13.18,6.97 13.18,5.4 CON_USB.1
  Route15 0.406: v4.65,13.98 4.34,13.98 3.35,12.99 3.35,8.65 5.03,6.97 v13.18,6.97 15.39,6.97 16.92,8.49 18.9,8.49 19.13,8.27 20.5,8.27 20.73,8.49 29.57,8.49 31.62,6.44 36.88,6.44 37.34,6.89 37.34,8.42 36.65,9.1 36.65,11.08 39.01,13.45 v39.01,15.73
  Bottom 0.152: v39.01,15.73 39.25,15.96 U2.42
V_BAT
  Top 0.406: 3.22,24.27 3.23,24.25 CON_CAN/I2C1.2 5.1,24.23 6.57,24.23 JP2.P$2 6.72,24.23 R17.P$1
  pour Top (no thermals): 2.31,24.65 2.31,23.73 3.91,23.73 3.91,24.65
V_BAT_MEAS  (via drill 0.31)
  Top 0.152: R18.P$1 7.37,22.66 R17.P$2 8.44,23.23 9.1,23.89 15.46,23.89 16.05,23.31 v16.05,22.82
  Bottom 0.152: U2.24 34.72,21.76 34.41,21.45 33.45,21.45 32.87,20.86 30.79,20.86 30.3,21.35 28.17,21.35 27.3,22.21 25.86,22.21 25.15,22.92 16.15,22.92 v16.05,22.82
V_IN  (via drill 0.31)
  Top 0.152: C39.+ 39.11,12.66
  Top 0.406: 3.15,23 CON_CAN/I2C1.3 6.34,23 JP2.P$1 6.65,21.38 6.88,21.14 JP3.P$1 7.45,20.23 IC9.1 6.76,19.96 6.5,19.7 6.5,18.5 6.94,18.06 IC9.3 7.72,18.05 7.72,17.48 6.87,16.63 C3.P$1 5.91,15.62 D3.C | 3.15,23 3.1,23 3.07,22.97 | 3.15,23 2.52,22.37 2.52,21.83 2.08,21.4 v2.08,21.02 | VREG1.2 41.12,15.94 41.6,16.42 42.1,16.42 C38.P$1 | v17.68,7.86 17.77,7.86 R23.P$2 18.78,8.37 19.05,8.65 19.05,9.33 19.43,9.71 20.8,9.71 21.11,10.02 21.11,10.78 21.3,10.98 JP8.P$1 | v24.92,22.29 24.94,22.26 JP4.P$1 | 39.11,12.66 40.13,11.64 v40.62,11.64 | 39.11,12.83 39.11,11.32 JP1.P$2
  Top 0.508: VREG1.1 VREG1.2
  Top 0.61: C39.+ 39.11,12.83 39.11,14.28 39.5,14.67 VREG1.1
  Bottom 0.406: 21.31,21.88 IMU.P$2 23.46,21.88 v23.49,21.85 | JP6.P$1 39.4,5.84 v39.4,6.51
  pour Top (no thermals): 2.31,23.35 2.31,22.44 3.91,22.44 3.91,23.35
  pour Route15 (isolate 0.203): 40.89,11.95 40.89,4.05 0.51,4.05 0.51,29.04 22.35,29.04 22.35,22.69 25.15,22.69 25.15,20.91 21.84,20.91 20.57,22.18 20.57,27.01 5.84,27.01 3.1,23.66 3.02,8.77 4.8,6.97 16.13,6.97 17.58,8.42 17.53,8.42 29.26,8.49 29.21,8.47 31.24,6.44 37.08,6.44 38.35,7.71 38.35,11.95
VDDA
  Bottom 0.305: U2.13 28.13,18.96 27.98,19.12 C31.P$2 26.45,19.12 26.2,18.87 25.24,18.87 | C28.+ 25.24,18.87 | 25.24,18.87 L1.P$2
VSS1
  Bottom 0.152: U2.31 38.22,23.81 JP12.P$1
  Bottom 0.406: C7.P$2 38.41,23.84 JP12.P$1
VSS2  (via drill 0.31)
  Top 0.406: JP13.P$1 41.95,13.64 v41.76,13.45 41.49,13.72 C14.P$2
  Bottom 0.305: U2.47 41.74,13.46 v41.76,13.45

## Text on the board
Top: LISA_M_V2_0_R1 TOP LAYER
Route2: LISA_M_V2_0_R1 LAYER 2
Route15: LISA_M_V2_0_R1 LAYER 3
Bottom: LISA_M_V2_0_R1 BOTTOM LAYER
tPlace: LISA_M_V2_0_R1 SILK SCREEN TOP | S1 | SPI1 | UART2 | I2C2 | JP2 | Lisa/M | BAT | V2.0 | (C)TR | VIN | 2011 | S3 | S2 | CL | ALOG2 | ALOG1 | CAN | CH | CL | DA | I2C1 | L5 | L6 | S5 | S4 | L4 | L3 | L7 | REG3V3 | L2 | VIN | L8 | 3V3 | CMP2 | L1 | LVIN | VS | S7 | S6 | GPIO | USB | JTAG | RC RX | UART3 | S8
bPlace: LISA_M_V2_0_R1 SILK SCREEN BOTTOM | DRDY | SCK | MISO | MOSI | GND | SDA | SCL | 3V3 | GND | I2C2 | SS | 3V3 | SPI1 | RX | TX | VCC | GND | S1 | Lisa/M | v2.0 | CMP1 | GND | UART2 | 2011 | (C)TR | I2C1CAN | 3V3 | ACC_DRDY | GND | Paparazzi | S2 | S3 | ASPIRIN_IMU | V_IN | UAV | ACC_CS | MISO | SDA | MOSI | S4 | S5 | SCL | GYRO_DRDY | SCK | USB | MAG_DRDY | Robotics | S6 | S7 | GYRO_SS | Transition | GND | RX | 3V3 | GND | VCC | TX | RX | USB | GND | 3V3 | PC12 | TRST | USB | RC | V_IN | GPIO | GND | 3V3 | RX1 | GND | 3V3 | RX5 | UART3 | GND | D+ | D- | UBUS | S8
tNames: J1&2 | J3&4 | Q1 | JTAG | J5&6 | J7&8 | CON_USB_MICRO
tStop: LISA_M_V1_1_R0 SOLDER MASK TOP
bStop: LISA_M_V1_1_R0 SOLDER MASK BOTTOM
tCream: LISA_M_V1_1_R0 SOLDER PASTE TOP
bCream: LISA_M_V1_1_R0 SOLDER PASTE BOTTOM
Measures: 47mm | 25.3mm
Reference: (C) 2010-2011 Antoine Drouin <poinix@gmail.com> | Licensed under: | (C) 2010-2011 Piotr Esden-Tempski <piotr@esden.net> | (C) 2011 Richard Hatano <rhatano@jobyenergy.com> | CC-BY-SA 3.0 | (C) 2011 Joby Robotics <info@jobyrobotics.com> | (C) 2011 Transition Robotics <info@transition-robotics.com> | http://creativecommons.org/licenses/by-sa/3.0/
DrillLegend: LISA_M_V1_R0 DRILL LEGEND